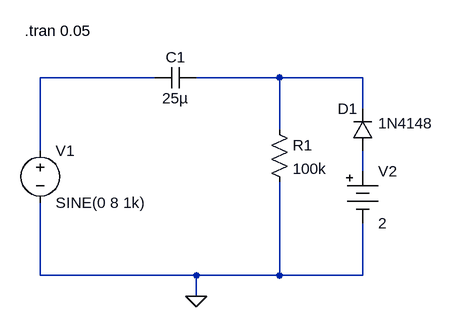
[diagram p0: schematic Ex-7.asc]
Ex-7.asc, the LTspice schematic file:
Version 4
SHEET 1 880 680
WIRE 176 0 0 0
WIRE 368 0 240 0
WIRE 496 0 368 0
WIRE 496 48 496 0
WIRE 368 80 368 0
WIRE 0 112 0 0
WIRE 496 144 496 112
WIRE 0 304 0 192
WIRE 240 304 0 304
WIRE 368 304 368 160
WIRE 368 304 240 304
WIRE 496 304 496 224
WIRE 496 304 368 304
WIRE 240 336 240 304
FLAG 240 336 0
SYMBOL voltage 0 96 R0
WINDOW 123 0 0 Left 0
WINDOW 39 0 0 Left 0
SYMATTR InstName V1
SYMATTR Value SINE(0 8 1k)
SYMBOL cap 240 -16 R90
WINDOW 0 0 32 VBottom 2
WINDOW 3 32 32 VTop 2
SYMATTR InstName C1
SYMATTR Value 25µ
SYMBOL diode 512 112 R180
WINDOW 0 24 64 Left 2
WINDOW 3 -93 42 Left 2
SYMATTR InstName D1
SYMATTR Value 1N4148
SYMBOL Misc\\battery 496 128 R0
WINDOW 123 0 0 Left 0
WINDOW 39 0 0 Left 0
SYMATTR InstName V2
SYMATTR Value 2
SYMBOL res 352 64 R0
SYMATTR InstName R1
SYMATTR Value 100k
TEXT -24 -72 Left 2 !.tran 0.05

The netlist it stands for:
* Ex-7.asc
V1 N001 0 SINE(0 8 1k)
C1 N002 N001 25µ
D1 N003 N002 1N4148
V2 N003 0 2
R1 N002 0 100k
.model D D
.lib standard.dio
.tran 0.05
.backanno
.end